# Altium schematic sheet MCU.SchDoc
size A4
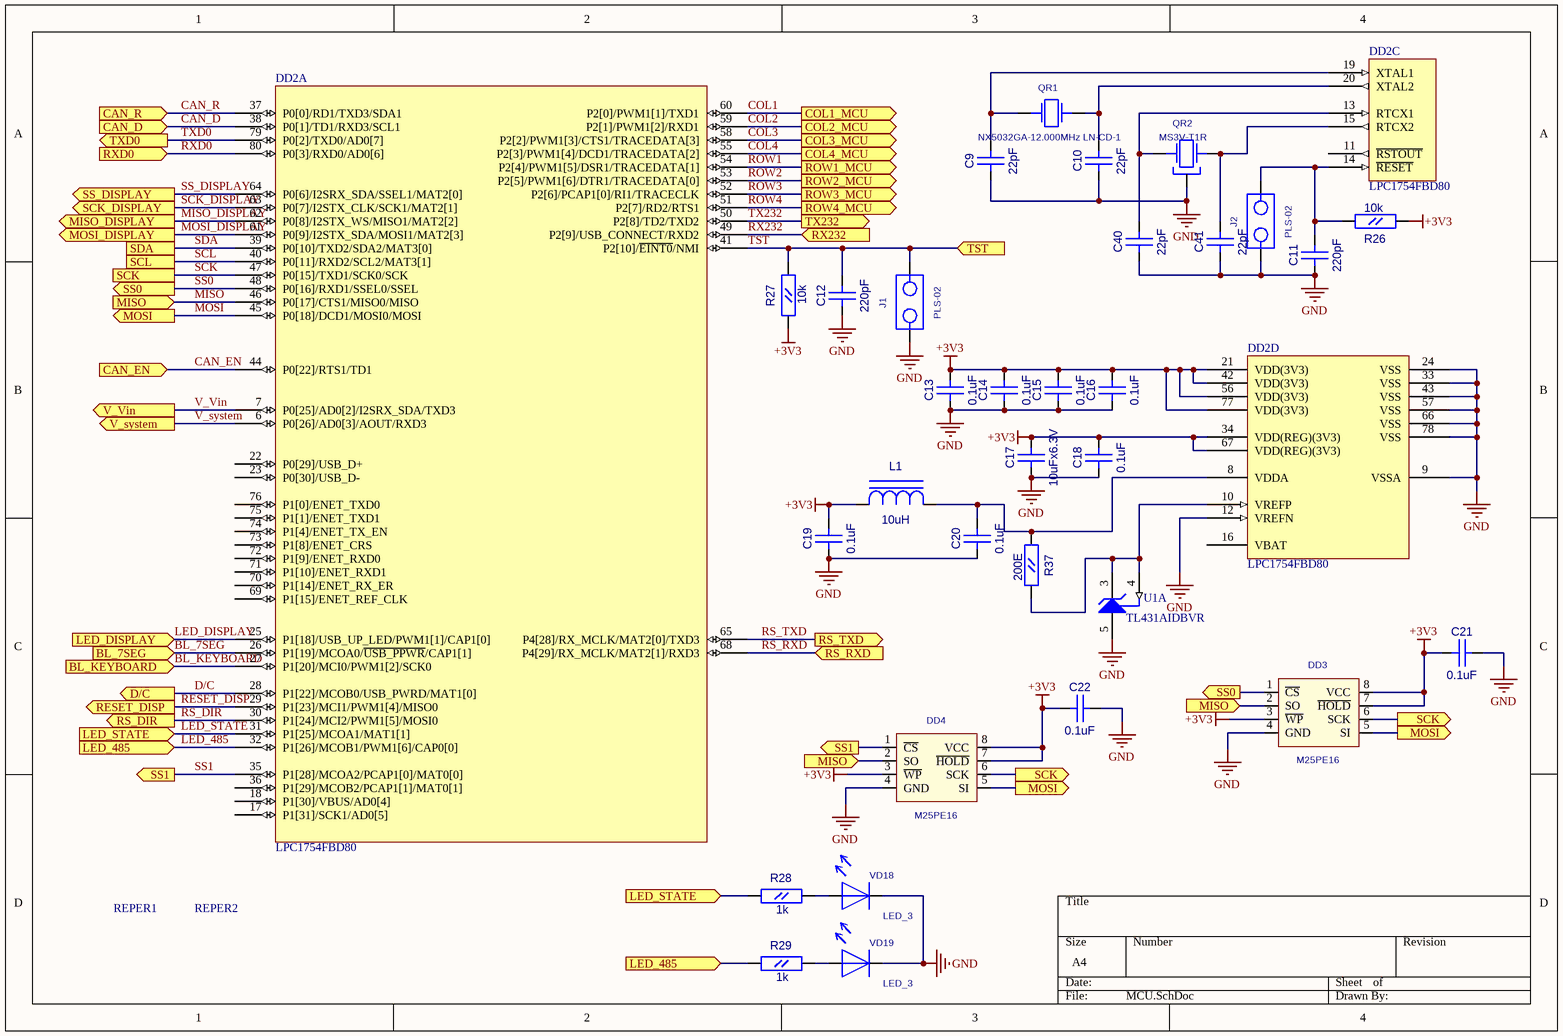
[diagram p0: MCU.SchDoc]

## Parts
C9  22pF  [CC0603]
C10  22pF  [CC0603]
C11  220pF  [CC0603]
C12  220pF  [CC0603]
C13  0.1uF  [CC0603]
C14  0.1uF  [CC0603]
C15  0.1uF  [CC0603]
C16  0.1uF  [CC0603]
C17  10uFx6.3V  [CC0805]
C18  0.1uF  [CC0603]
C19  0.1uF  [CC0603]
C20  0.1uF  [CC0603]
C21  0.1uF  [CC0603]
C22  0.1uF  [CC0603]
C40  22pF  [CC0603]
C41  22pF  [CC0603]
DD2  LPC1754FBD80  [TQFP-80_0.5]  (parts A,C,D of 4)
DD3  M25PE16  [EIAJ_SO8]
DD4  M25PE16  [EIAJ_SO8]
J1  PLS-02  [PLS-02]
J2  PLS-02  [PLS-02]
L1  10uH  [L0603]
QR1  NX5032GA-12.000MHz LN-CD-1  [AC5032_2]
QR2  MS3V-T1R  [MS3V-T1R]
R26  10k  [RC0603]
R27  10k  [RC0603]
R28  1k  [RC0603]
R29  1k  [RC0603]
R37  200E  [RC0603]
REPER1  REPER1.2  [REPER1.2]  (value not drawn)
REPER2  REPER1.2  [REPER1.2]  (value not drawn)
U1  TL431AIDBVR  [TI-DBV5_N]  (part A of 2)
VD18  LED_3  [LED3]
VD19  LED_3  [LED3]

## Ports
BL_7SEG (in), BL_KEYBOARD (in), CAN_D (in), CAN_EN (in), CAN_R (in), COL1_MCU (out), COL2_MCU (out), COL3_MCU (out), COL4_MCU (out), D/C (out), LED_485 (in), LED_DISPLAY (in), LED_STATE (in), MISO (in), MISO_DISPLAY (out), MOSI (out), MOSI_DISPLAY (out), RESET_DISP (out), ROW1_MCU (out), ROW2_MCU (out), ROW3_MCU (out), ROW4_MCU (out), RS_DIR (out), RS_RXD (in), RS_TXD (out), RX232 (in), RXD0 (in), SCK, SCK (out), SCK_DISPLAY (out), SCL, SDA, SS0 (out), SS1 (out), SS_DISPLAY (out), TST (in), TX232 (out), TXD0 (out), V_system (out), V_Vin (out)

## Nets
+3V3: C13.2(B) C14.2(B) C15.2(B) C16.2(B) C17.2(B) C18.2(B) C19.2(B) C21.1(A) C22.1(A) DD2.21(VDD(3V3)) DD2.34(VDD(REG)(3V3)) DD2.42(VDD(3V3)) DD2.56(VDD(3V3)) DD2.67(VDD(REG)(3V3)) DD2.77(VDD(3V3)) DD3.3(~{WP}) DD3.7(~{HOLD}) DD3.8(VCC) DD4.3(~{WP}) DD4.7(~{HOLD}) DD4.8(VCC) L1.1(A) R26.1(A) R27.1(A)
GND: C9.1(A) C10.1(A) C11.1(A) C12.1(A) C13.1(A) C14.1(A) C15.1(A) C16.1(A) C17.1(A) C18.1(A) C19.1(A) C20.1(A) C21.2(B) C22.2(B) C40.1(A) C41.1(A) DD2.9(VSSA) DD2.12(VREFN) DD2.24(VSS) DD2.33(VSS) DD2.43(VSS) DD2.57(VSS) DD2.66(VSS) DD2.78(VSS) DD3.4(GND) DD4.4(GND) J1.1 J2.1 QR2.3 U1.5(ANODE) VD18.1 VD19.1
BL_7SEG: DD2.26(P1[19]/MCOA0/~{USB_PPWR}/CAP1[1]) ; port BL_7SEG
BL_KEYBOARD: DD2.27(P1[20]/MCI0/PWM1[2]/SCK0) ; port BL_KEYBOARD
CAN_D: DD2.38(P0[1]/TD1/RXD3/SCL1) ; port CAN_D
CAN_EN: DD2.44(P0[22]/RTS1/TD1) ; port CAN_EN
CAN_R: DD2.37(P0[0]/RD1/TXD3/SDA1) ; port CAN_R
COL1: DD2.60(P2[0]/PWM1[1]/TXD1) ; port COL1_MCU
COL2: DD2.59(P2[1]/PWM1[2]/RXD1) ; port COL2_MCU
COL3: DD2.58(P2[2]/PWM1[3]/CTS1/TRACEDATA[3]) ; port COL3_MCU
COL4: DD2.55(P2[3]/PWM1[4]/DCD1/TRACEDATA[2]) ; port COL4_MCU
D/C: DD2.28(P1[22]/MCOB0/USB_PWRD/MAT1[0]) ; port D/C
LED_485: DD2.32(P1[26]/MCOB1/PWM1[6]/CAP0[0]) R29.1(A) ; port LED_485
LED_DISPLAY: DD2.25(P1[18]/USB_UP_LED/PWM1[1]/CAP1[0]) ; port LED_DISPLAY
LED_STATE: DD2.31(P1[25]/MCOA1/MAT1[1]) R28.1(A) ; port LED_STATE
MISO: DD2.46(P0[17]/CTS1/MISO0/MISO) DD3.2(SO) DD4.2(SO) ; port MISO
MISO_DISPLAY: DD2.62(P0[8]/I2STX_WS/MISO1/MAT2[2]) ; port MISO_DISPLAY
MOSI: DD2.45(P0[18]/DCD1/MOSI0/MOSI) DD3.5(SI) DD4.5(SI) ; port MOSI
MOSI_DISPLAY: DD2.61(P0[9]/I2STX_SDA/MOSI1/MAT2[3]) ; port MOSI_DISPLAY
RESET_DISP: DD2.29(P1[23]/MCI1/PWM1[4]/MISO0) ; port RESET_DISP
ROW1: DD2.54(P2[4]/PWM1[5]/DSR1/TRACEDATA[1]) ; port ROW1_MCU
ROW2: DD2.53(P2[5]/PWM1[6]/DTR1/TRACEDATA[0]) ; port ROW2_MCU
ROW3: DD2.52(P2[6]/PCAP1[0]/RI1/TRACECLK) ; port ROW3_MCU
ROW4: DD2.51(P2[7]/RD2/RTS1) ; port ROW4_MCU
RS_DIR: DD2.30(P1[24]/MCI2/PWM1[5]/MOSI0) ; port RS_DIR
RS_RXD: DD2.68(P4[29]/RX_MCLK/MAT2[1]/RXD3) ; port RS_RXD
RS_TXD: DD2.65(P4[28]/RX_MCLK/MAT2[0]/TXD3) ; port RS_TXD
RX232: DD2.49(P2[9]/USB_CONNECT/RXD2) ; port RX232
RXD0: DD2.80(P0[3]/RXD0/AD0[6]) ; port RXD0
SCK: DD2.47(P0[15]/TXD1/SCK0/SCK) DD3.6(SCK) DD4.6(SCK) ; port SCK
SCK_DISPLAY: DD2.63(P0[7]/I2STX_CLK/SCK1/MAT2[1]) ; port SCK_DISPLAY
SCL: DD2.40(P0[11]/RXD2/SCL2/MAT3[1]) ; port SCL
SDA: DD2.39(P0[10]/TXD2/SDA2/MAT3[0]) ; port SDA
SS0: DD2.48(P0[16]/RXD1/SSEL0/SSEL) DD3.1(~{CS}) ; port SS0
SS1: DD2.35(P1[28]/MCOA2/PCAP1[0]/MAT0[0]) DD4.1(~{CS}) ; port SS1
SS_DISPLAY: DD2.64(P0[6]/I2SRX_SDA/SSEL1/MAT2[0]) ; port SS_DISPLAY
TST: C12.2(B) DD2.41(P2[10]/~{EINT0}/NMI) J1.2 R27.2(B) ; port TST
TX232: DD2.50(P2[8]/TD2/TXD2) ; port TX232
TXD0: DD2.79(P0[2]/TXD0/AD0[7]) ; port TXD0
V_system: DD2.6(P0[26]/AD0[3]/AOUT/RXD3) ; port V_system
V_Vin: DD2.7(P0[25]/AD0[2]/I2SRX_SDA/TXD3) ; port V_Vin
NetC9_2: C9.2(B) DD2.19(XTAL1) QR1.1
NetC10_2: C10.2(B) DD2.20(XTAL2) QR1.2
NetC11_2: C11.2(B) DD2.14(~{RESET}) J2.2 R26.2(B)
NetC20_2: C20.2(B) DD2.8(VDDA) L1.2(C) R37.1(A)
NetC40_2: C40.2(B) DD2.13(RTCX1) QR2.2(X2)
NetC41_2: C41.2(B) DD2.15(RTCX2) QR2.1(X1)
NetDD2_10: DD2.10(VREFP) R37.2(B) U1.3(CATHODE) U1.4(REF)
NetR28_2: R28.2(B) VD18.2
NetR29_2: R29.2(B) VD19.2

Not connected (* = marked no-connect by the designer): DD2 11(~{RSTOUT}) 16(VBAT) 17(P1[31]/SCK1/AD0[5]) 18(P1[30]/VBUS/AD0[4]) 22(P0[29]/USB_D+) 23(P0[30]/USB_D-) 36(P1[29]/MCOB2/PCAP1[1]/MAT0[1]) 69(P1[15]/ENET_REF_CLK) 70(P1[14]/ENET_RX_ER) 71(P1[10]/ENET_RXD1) 72(P1[9]/ENET_RXD0) 73(P1[8]/ENET_CRS) 74(P1[4]/ENET_TX_EN) 75(P1[1]/ENET_TXD1) 76(P1[0]/ENET_TXD0); REPER1 1; REPER2 1

## Library data of the parts
C9-C16 C18-C22 C40 C41 = CC0603
  C9 C10 C40 C41: Value: 22pF
  C11 C12: Value: 220pF
  C13-C16 C18-C22: Value: 0.1uF
C17 = CC0805: Value: 10uFx6.3V
DD2 = LPC1754FBD80: Cortex -M3 32-Bit Microcontroller, 128KB Flash, 64KB RAM, 800-Lead LQFP; ComponentLink1Description: Manufacturer Link; ComponentLink1URL: http://www.nxp.com/
DD3 DD4 = S25FL016A0LMFI01: Value: M25PE16
L1 = L0603: Value: 10uH
QR1 = AC5032_2: AC5032/2; Value: NX5032GA-12.000MHz LN-CD-1
QR2 = MS3V-T1R: CRYSTAL_32768 Hz; Value: *
R26-R29 R37 = RC0603
  R26 R27: Value: 10k
  R28 R29: Value: 1k
  R37: Value: 200E
U1 = TL431AIDBVR: Adjustable Precision Shunt Regulator, 34 ppm / degC, 100 mA, -40 to 85 degC, 5-pin SOT-23 (DBV), Green (RoHS & no Sb/Br); Manufacturer: Texas Instruments; Initial Accuracy @ 25/deg C(%): 1; Iout/Iz(Max)(mA): 100; Min Iz for Regulation(uA): 600; Rating: Catalog; SubFamily: Shunt Voltage Reference; Temp Coeff(Max)(ppm/ degree C): 92; Temp Coeff(Typ)(ppm/ degree C): 34; VO Adj(Max)(V): 36; VO Adj(Min)(V): 2.495; DatasheetVersion: SLVS543M; PackageVersion: 4073253-4/K; PackageReference: DBV5; PackageDescription: 5-Pin Plastic Small Outline, Body 1.60 Ч 2.90 mm, Pitch 0.95 mm; Supplier 1: Digi-Key; Supplier Part Number 1: 296-15237-2-ND; Supplier 2: Digi-Key; Supplier Part Number 2: 296-15237-1-ND; Supplier 3: Digi-Key; Supplier Part Number 3: 296-15237-6-ND; Supplier 4: Newark; Supplier Part Number 4: 61H5522; Supplier 5: Mouser; Supplier Part Number 5: 595-TL431AIDBVR; Eco-Plan: Green (RoHS & no Sb/Br); Mounting Technology: Surface Mount; Code_JEDEC: MO-178; PartNumber: TL431AIDBVR; ComponentLink1Description: Manufacturer URL; ComponentLink1URL: http://www.ti.com/; ComponentLink2Description: Datasheet; ComponentLink2URL: http://www.ti.com/general/docs/lit/getliterature.tsp?genericPartNumber=TL431A&fileType=pdf; ComponentLink3Description: Package Specification; ComponentLink3URL: http://www.ti.com/litv/pdf/mpds018i; ComponentLink4Description: URL Link1; ComponentLink4URL: Samples URL:http://www.ti.com/product/tl431a
J1 J2 = PLS-02: Value: *
REPER1 REPER2 = REPER1.2: Value: *
VD18 VD19 = LED_3: Value: *